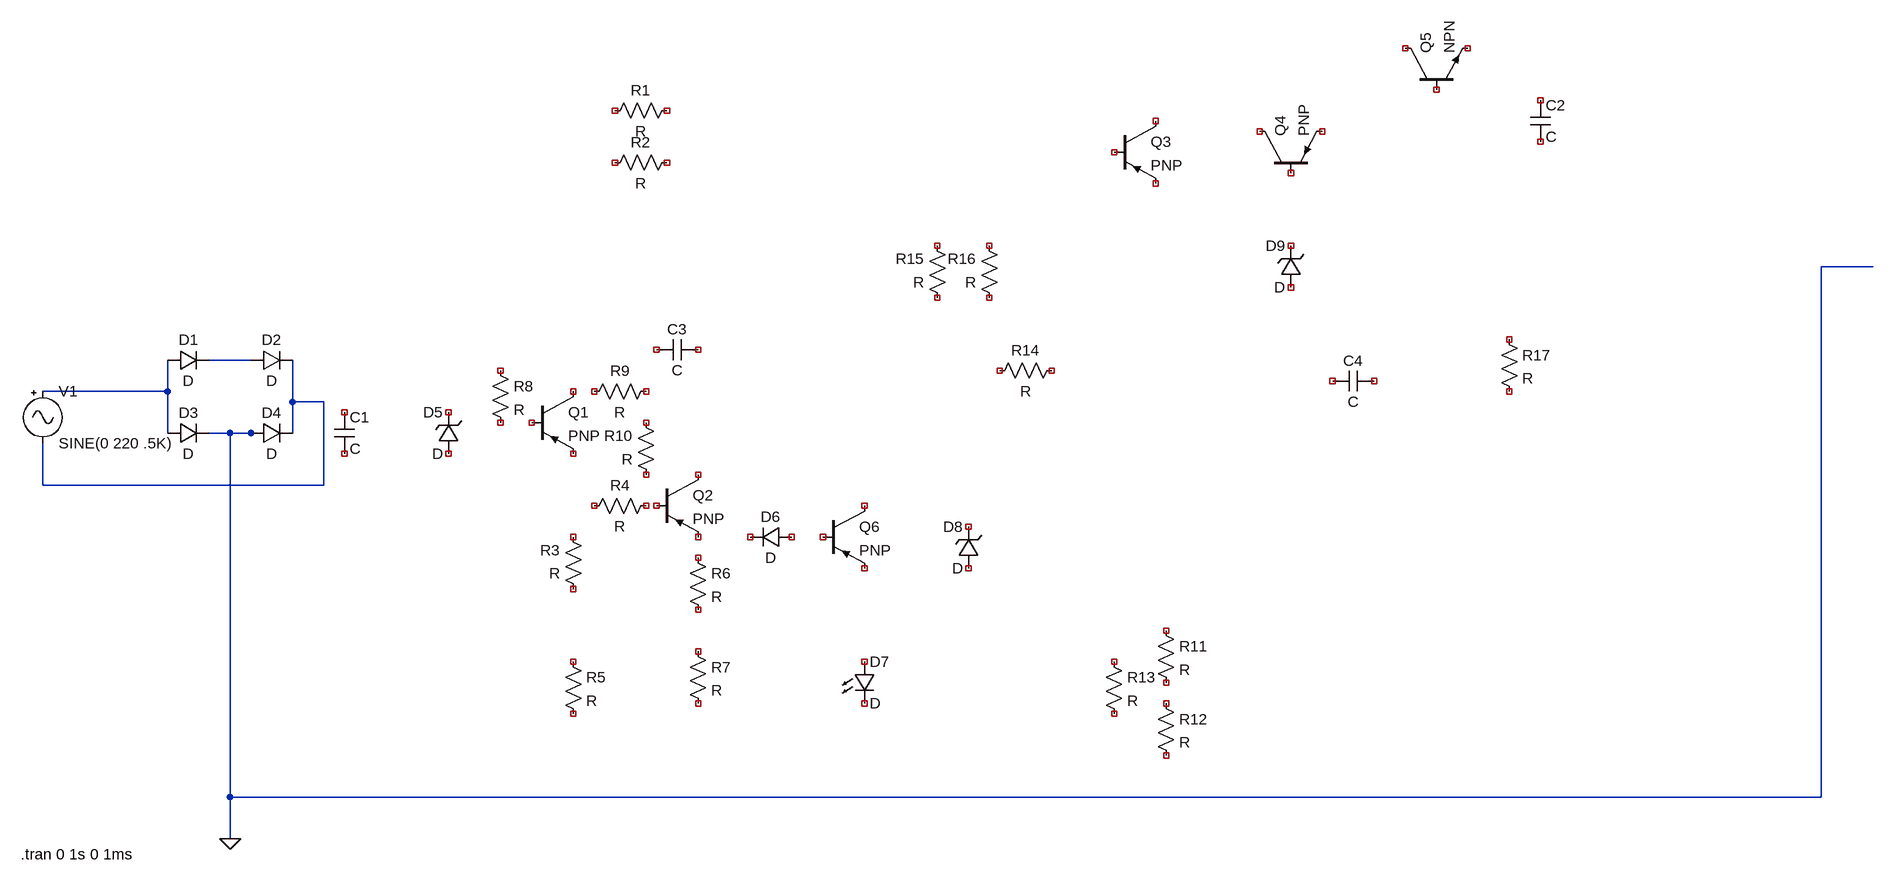
[diagram p0: schematic Draft2.asc]
Draft2.asc, the LTspice schematic file:
Version 4
SHEET 1 1412 936
WIRE 1408 16 1328 16
WIRE -1088 160 -1152 160
WIRE -1216 208 -1216 160
WIRE -1216 208 -1408 208
WIRE -1024 224 -1024 160
WIRE -976 224 -1024 224
WIRE -1216 272 -1216 208
WIRE -1120 272 -1152 272
WIRE -1088 272 -1120 272
WIRE -1072 272 -1088 272
WIRE -1024 272 -1024 224
WIRE -1408 352 -1408 288
WIRE -976 352 -976 224
WIRE -976 352 -1408 352
WIRE -1120 832 -1120 272
WIRE 1328 832 1328 16
WIRE 1328 832 -1120 832
WIRE -1120 896 -1120 832
FLAG -1120 896 0
SYMBOL diode -1216 176 R270
WINDOW 0 32 32 VTop 2
WINDOW 3 0 32 VBottom 2
SYMATTR InstName D1
SYMBOL diode -1088 176 R270
WINDOW 0 32 32 VTop 2
WINDOW 3 0 32 VBottom 2
SYMATTR InstName D2
SYMBOL diode -1216 288 R270
WINDOW 0 32 32 VTop 2
WINDOW 3 0 32 VBottom 2
SYMATTR InstName D3
SYMBOL diode -1088 288 R270
WINDOW 0 32 32 VTop 2
WINDOW 3 0 32 VBottom 2
SYMATTR InstName D4
SYMBOL Misc\\signal -1408 192 R0
WINDOW 123 0 0 Left 0
WINDOW 39 0 0 Left 0
SYMATTR InstName V1
SYMATTR Value SINE(0 220 .5K)
SYMBOL cap -960 240 R0
SYMATTR InstName C1
SYMBOL zener -768 304 R180
WINDOW 0 24 64 Left 2
WINDOW 3 24 0 Left 2
SYMATTR InstName D5
SYMBOL pnp -656 208 R0
SYMATTR InstName Q1
SYMBOL pnp -464 336 R0
SYMATTR InstName Q2
SYMBOL pnp 240 -208 R0
SYMATTR InstName Q3
SYMBOL pnp 464 -128 R270
SYMATTR InstName Q4
SYMBOL npn 688 -256 R270
SYMATTR InstName Q5
SYMBOL res -432 -240 R90
WINDOW 0 0 56 VBottom 2
WINDOW 3 32 56 VTop 2
SYMATTR InstName R1
SYMBOL res -432 -160 R90
WINDOW 0 0 56 VBottom 2
WINDOW 3 32 56 VTop 2
SYMATTR InstName R2
SYMBOL res -576 528 R180
WINDOW 0 36 76 Left 2
WINDOW 3 36 40 Left 2
SYMATTR InstName R3
SYMBOL res -576 400 R270
WINDOW 0 32 56 VTop 2
WINDOW 3 0 56 VBottom 2
SYMATTR InstName R4
SYMBOL res -608 608 R0
SYMATTR InstName R5
SYMBOL res -416 448 R0
SYMATTR InstName R6
SYMBOL res -416 592 R0
SYMATTR InstName R7
SYMBOL res -720 160 R0
SYMATTR InstName R8
SYMBOL res -464 192 R90
WINDOW 0 0 56 VBottom 2
WINDOW 3 32 56 VTop 2
SYMATTR InstName R9
SYMBOL res -464 352 R180
WINDOW 0 36 76 Left 2
WINDOW 3 36 40 Left 2
SYMATTR InstName R10
SYMBOL pnp -208 384 R0
SYMATTR InstName Q6
SYMBOL diode -256 416 R90
WINDOW 0 0 32 VBottom 2
WINDOW 3 32 32 VTop 2
SYMATTR InstName D6
SYMBOL LED -160 624 R0
SYMATTR InstName D7
SYMBOL res 304 560 R0
SYMATTR InstName R11
SYMBOL res 304 672 R0
SYMATTR InstName R12
SYMBOL res 224 608 R0
SYMATTR InstName R13
SYMBOL cap 880 -240 R0
SYMATTR InstName C2
SYMBOL cap -400 128 R90
WINDOW 0 0 32 VBottom 2
WINDOW 3 32 32 VTop 2
SYMATTR InstName C3
SYMBOL zener 32 480 R180
WINDOW 0 24 64 Left 2
WINDOW 3 24 0 Left 2
SYMATTR InstName D8
SYMBOL res 160 160 R90
WINDOW 0 0 56 VBottom 2
WINDOW 3 32 56 VTop 2
SYMATTR InstName R14
SYMBOL res -16 80 R180
WINDOW 0 36 76 Left 2
WINDOW 3 36 40 Left 2
SYMATTR InstName R15
SYMBOL res 64 80 R180
WINDOW 0 36 76 Left 2
WINDOW 3 36 40 Left 2
SYMATTR InstName R16
SYMBOL zener 528 48 R180
WINDOW 0 24 64 Left 2
WINDOW 3 24 0 Left 2
SYMATTR InstName D9
SYMBOL cap 640 176 R90
WINDOW 0 0 32 VBottom 2
WINDOW 3 32 32 VTop 2
SYMATTR InstName C4
SYMBOL res 832 112 R0
SYMATTR InstName R17
TEXT -1442 920 Left 2 !.tran 0 1s 0 1ms

The netlist it stands for:
* Draft2.asc
D1 N002 N001 D
D2 N001 N003 D
D3 N002 0 D
D4 0 N003 D
V1 N002 N003 SINE(0 220 .5K)
C1 NC_01 NC_02 C
D5 NC_03 NC_04 D
Q1 NC_05 NC_06 NC_07 0 PNP
Q2 NC_08 NC_09 NC_10 0 PNP
Q3 NC_11 NC_12 NC_13 0 PNP
Q4 NC_14 NC_15 NC_16 0 PNP
Q5 NC_17 NC_18 NC_19 0 NPN
R1 NC_20 NC_21 R
R2 NC_22 NC_23 R
R3 NC_24 NC_25 R
R4 NC_26 NC_27 R
R5 NC_28 NC_29 R
R6 NC_30 NC_31 R
R7 NC_32 NC_33 R
R8 NC_34 NC_35 R
R9 NC_36 NC_37 R
R10 NC_38 NC_39 R
Q6 NC_40 NC_41 NC_42 0 PNP
D6 NC_43 NC_44 D
D7 NC_45 NC_46 D
R11 NC_47 NC_48 R
R12 NC_49 NC_50 R
R13 NC_51 NC_52 R
C2 NC_53 NC_54 C
C3 NC_55 NC_56 C
D8 NC_57 NC_58 D
R14 NC_59 NC_60 R
R15 NC_61 NC_62 R
R16 NC_63 NC_64 R
D9 NC_65 NC_66 D
C4 NC_67 NC_68 C
R17 NC_69 NC_70 R
.model D D
.lib standard.dio
.model NPN NPN
.model PNP PNP
.lib standard.bjt
.tran 0 1s 0 1ms
.backanno
.end